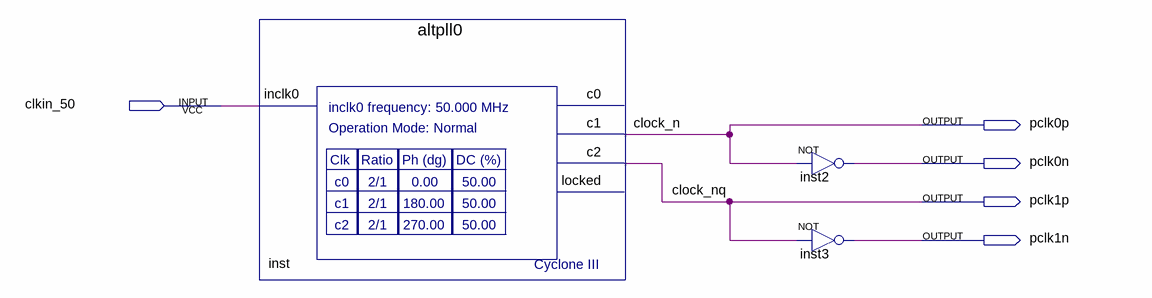
[diagram p0: schematic sheet]
// Quartus schematic ep3c120_pll_clkout.bdf as structural Verilog: 3 symbols, 5 pins
module ep3c120_pll_clkout (
  input  clkin_50,
  output pclk0p,
  output pclk0n,
  output pclk1p,
  output pclk1n
);

  altpll0 inst (.inclk0(clkin_50), .c1(pclk0p), .c2(pclk1p));  // open: c0, locked
  not inst2 (pclk0n, pclk0p);
  not inst3 (pclk1n, pclk1p);

  // Other names for the same wires on the sheet: clock_n = pclk0p; clock_nq = pclk1p
endmodule
